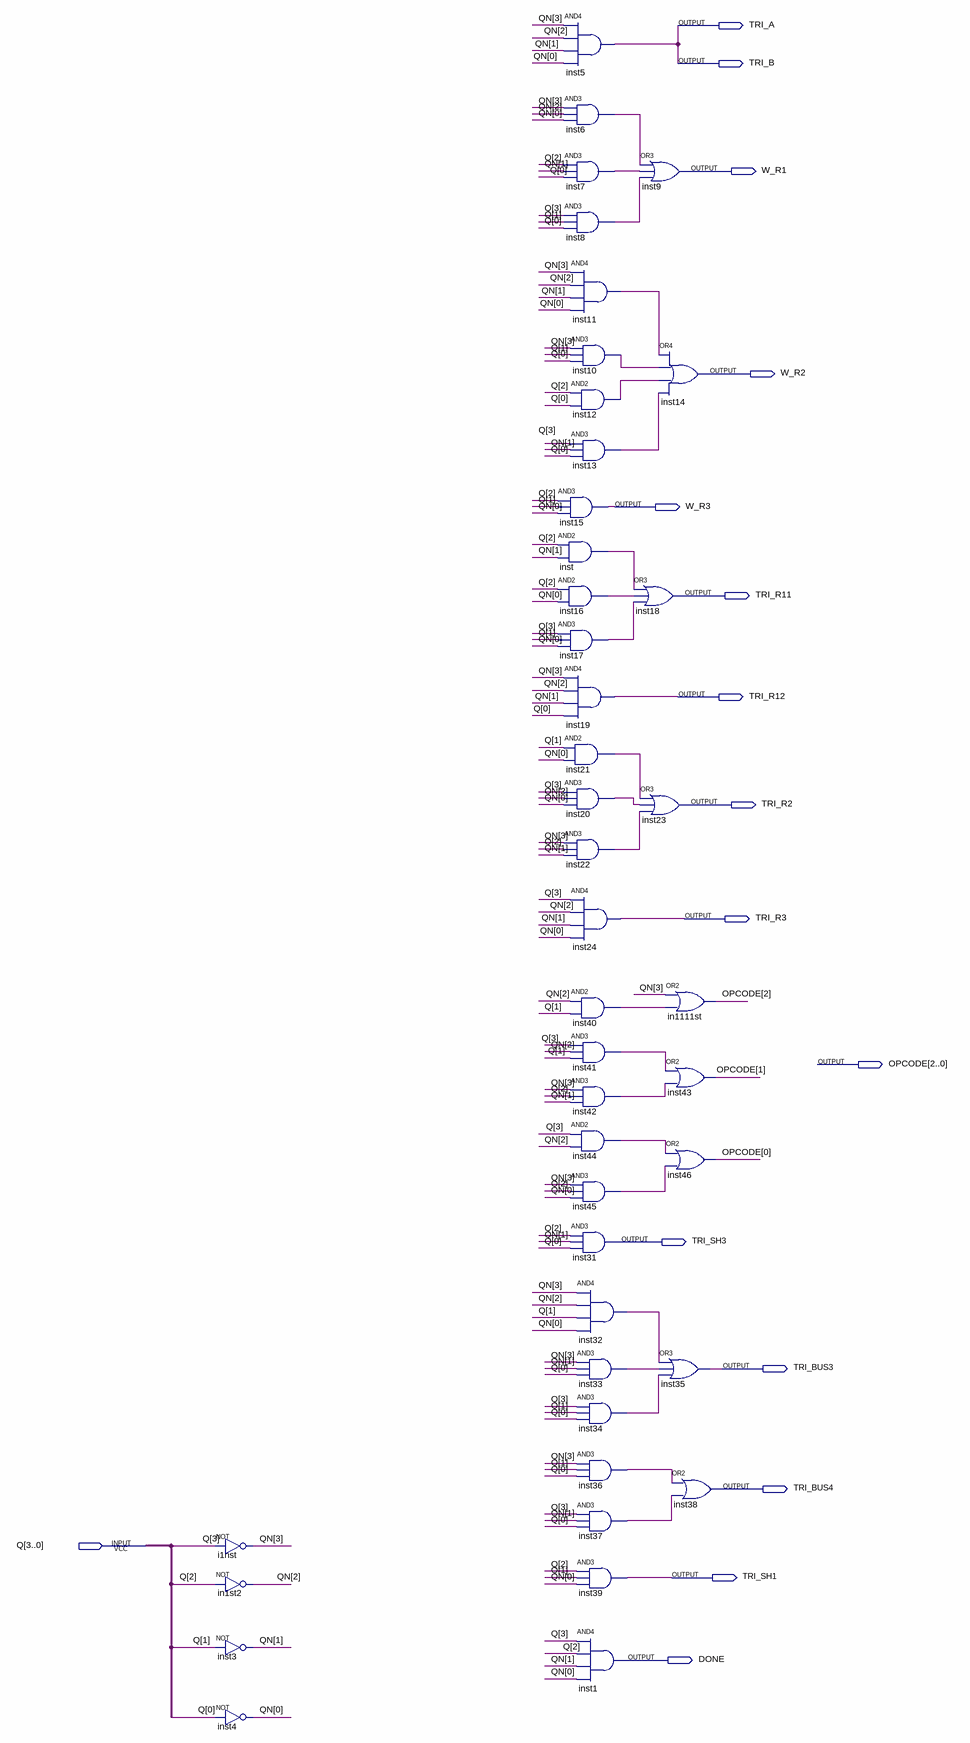
[diagram p0: schematic sheet]
// Quartus schematic ENCODER.bdf as structural Verilog: 43 symbols, 16 pins
module ENCODER (
  input  [3:0] Q,
  output TRI_A,
  output TRI_B,
  output W_R1,
  output W_R2,
  output W_R3,
  output TRI_R11,
  output TRI_R12,
  output TRI_R2,
  output TRI_R3,
  output [2:0] OPCODE,
  output TRI_SH3,
  output TRI_BUS3,
  output TRI_BUS4,
  output TRI_SH1,
  output DONE
);

  wire inst6_out, inst7_out, inst8_out, inst10_out, inst11_out, inst12_out, inst13_out, inst16_out,
       inst17_out, inst20_out, inst21_out, inst22_out, inst32_out, inst33_out, inst34_out, inst36_out,
       inst37_out, inst40_out, inst41_out, inst42_out, inst44_out, inst45_out, inst_out;
  wire [3:0] QN;

  not i1nst (QN[3], Q[3]);
  not in1st2 (QN[2], Q[2]);
  not inst3 (QN[1], Q[1]);
  not inst4 (QN[0], Q[0]);
  and inst5 (TRI_A, QN[3], QN[2], QN[1], QN[0]);
  and inst6 (inst6_out, QN[3], QN[2], QN[0]);
  and inst7 (inst7_out, Q[2], QN[1], Q[0]);
  and inst8 (inst8_out, Q[3], Q[1], Q[0]);
  and inst11 (inst11_out, QN[3], QN[2], QN[1], QN[0]);
  and inst10 (inst10_out, QN[3], Q[1], Q[0]);
  and inst12 (inst12_out, Q[2], Q[0]);
  and inst13 (inst13_out, Q[3], QN[1], Q[0]);
  and inst15 (W_R3, Q[2], Q[1], QN[0]);
  and inst (inst_out, Q[2], QN[1]);
  and inst16 (inst16_out, Q[2], QN[0]);
  and inst17 (inst17_out, Q[3], Q[1], QN[0]);
  and inst19 (TRI_R12, QN[3], QN[2], QN[1], Q[0]);
  and inst21 (inst21_out, Q[1], QN[0]);
  and inst20 (inst20_out, Q[3], QN[2], QN[0]);
  and inst22 (inst22_out, QN[3], Q[2], QN[1]);
  and inst24 (TRI_R3, Q[3], QN[2], QN[1], QN[0]);
  and inst40 (inst40_out, QN[2], Q[1]);
  and inst41 (inst41_out, Q[3], QN[2], Q[1]);
  and inst42 (inst42_out, QN[3], Q[2], QN[1]);
  and inst44 (inst44_out, Q[3], QN[2]);
  and inst45 (inst45_out, QN[3], Q[2], QN[0]);
  and inst31 (TRI_SH3, Q[2], QN[1], Q[0]);
  and inst32 (inst32_out, QN[3], QN[2], Q[1], QN[0]);
  and inst33 (inst33_out, QN[3], QN[1], Q[0]);
  and inst34 (inst34_out, Q[3], Q[1], Q[0]);
  and inst36 (inst36_out, QN[3], Q[1], Q[0]);
  and inst37 (inst37_out, Q[3], QN[1], Q[0]);
  and inst39 (TRI_SH1, Q[2], Q[1], QN[0]);
  and inst1 (DONE, Q[3], Q[2], QN[1], QN[0]);
  or inst18 (TRI_R11, inst_out, inst16_out, inst17_out);
  or inst9 (W_R1, inst6_out, inst7_out, inst8_out);
  or inst14 (W_R2, inst11_out, inst10_out, inst12_out, inst13_out);
  or inst23 (TRI_R2, inst21_out, inst20_out, inst22_out);
  or in1111st (OPCODE[2], QN[3], inst40_out);
  or inst43 (OPCODE[1], inst41_out, inst42_out);
  or inst46 (OPCODE[0], inst44_out, inst45_out);
  or inst35 (TRI_BUS3, inst32_out, inst33_out, inst34_out);
  or inst38 (TRI_BUS4, inst36_out, inst37_out);

  assign TRI_B = TRI_A;
endmodule
